# Altium schematic sheet LTC2949_Main.SchDoc
size A
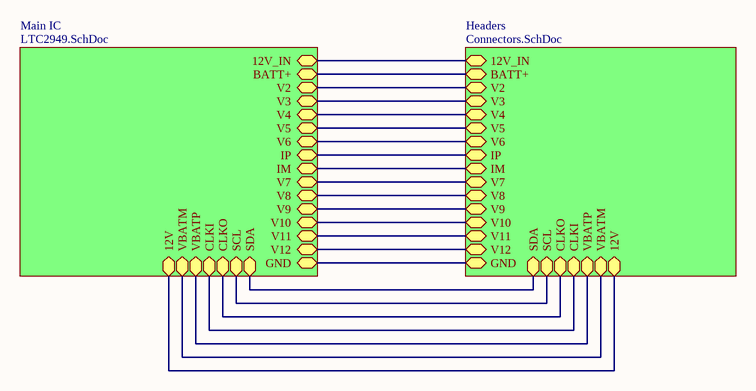
[diagram p0: LTC2949_Main.SchDoc]

## Sub-sheets
Headers = Connectors.SchDoc: IP (bidir), IM (bidir), V6 (bidir), V5 (bidir), V4 (bidir), V3 (bidir), V2 (bidir), BATT+ (bidir), V7 (bidir), V8 (bidir), V9 (bidir), V10 (bidir), V11 (bidir), V12 (bidir), GND (bidir), SDA (bidir), SCL (bidir), CLKO (bidir), CLKI (bidir), VBATP (bidir), VBATM (bidir), 12V (bidir), 12V_IN (bidir)
Main IC = LTC2949.SchDoc: IP (bidir), IM (bidir), V6 (bidir), V5 (bidir), V4 (bidir), V3 (bidir), V2 (bidir), BATT+ (bidir), V7 (bidir), V8 (bidir), V9 (bidir), V10 (bidir), V11 (bidir), V12 (bidir), GND (bidir), SDA (bidir), SCL (bidir), CLKO (bidir), CLKI (bidir), VBATP (bidir), VBATM (bidir), 12V (bidir), 12V_IN (bidir)

## Nets
(unnamed): sheet Main IC/IP, sheet Headers/IP
(unnamed): sheet Main IC/IM, sheet Headers/IM
(unnamed): sheet Main IC/V6, sheet Headers/V6
(unnamed): sheet Main IC/V5, sheet Headers/V5
(unnamed): sheet Main IC/V4, sheet Headers/V4
(unnamed): sheet Main IC/V3, sheet Headers/V3
(unnamed): sheet Main IC/V2, sheet Headers/V2
(unnamed): sheet Main IC/BATT+, sheet Headers/BATT+
(unnamed): sheet Main IC/V7, sheet Headers/V7
(unnamed): sheet Main IC/V8, sheet Headers/V8
(unnamed): sheet Main IC/V9, sheet Headers/V9
(unnamed): sheet Main IC/V10, sheet Headers/V10
(unnamed): sheet Main IC/V11, sheet Headers/V11
(unnamed): sheet Main IC/V12, sheet Headers/V12
(unnamed): sheet Main IC/GND, sheet Headers/GND
(unnamed): sheet Main IC/SDA, sheet Headers/SDA
(unnamed): sheet Main IC/SCL, sheet Headers/SCL
(unnamed): sheet Main IC/CLKO, sheet Headers/CLKO
(unnamed): sheet Main IC/CLKI, sheet Headers/CLKI
(unnamed): sheet Main IC/VBATP, sheet Headers/VBATP
(unnamed): sheet Main IC/VBATM, sheet Headers/VBATM
(unnamed): sheet Main IC/12V, sheet Headers/12V
(unnamed): sheet Main IC/12V_IN, sheet Headers/12V_IN